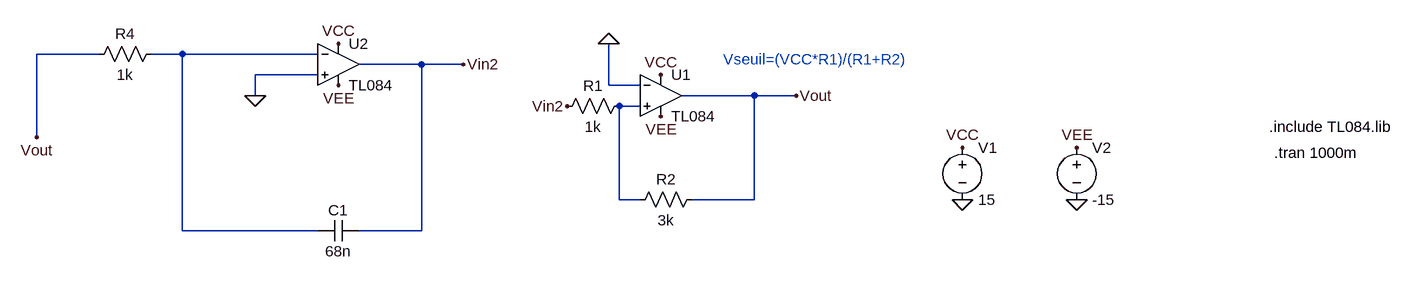
[diagram p0: schematic recovered_oscillo.asc]
recovered_oscillo.asc, the LTspice schematic file:
Version 4
SHEET 1 1840 792
WIRE -704 112 -800 112
WIRE -576 112 -624 112
WIRE -368 112 -576 112
WIRE -208 128 -304 128
WIRE -144 128 -208 128
WIRE -368 144 -464 144
WIRE 80 160 80 96
WIRE 128 160 80 160
WIRE -464 176 -464 144
WIRE 304 176 192 176
WIRE 368 176 304 176
WIRE 128 192 96 192
WIRE -800 240 -800 112
WIRE 96 336 96 192
WIRE 128 336 96 336
WIRE 304 336 304 176
WIRE 304 336 208 336
WIRE -576 384 -576 112
WIRE -368 384 -576 384
WIRE -208 384 -208 128
WIRE -208 384 -304 384
FLAG 624 336 0
FLAG 800 336 0
FLAG 624 256 VCC
FLAG 800 256 VEE
FLAG 160 208 VEE
FLAG 160 144 VCC
FLAG 368 176 Vout
FLAG -336 96 VCC
FLAG -336 160 VEE
FLAG -800 240 Vout
FLAG -144 128 Vin2
FLAG -464 176 0
FLAG 16 192 Vin2
FLAG 80 96 0
SYMBOL Opamps\\opamp2 160 112 R0
SYMATTR InstName U1
SYMATTR Value TL084
SYMBOL voltage 624 240 R0
SYMATTR InstName V1
SYMATTR Value 15
SYMBOL voltage 800 240 R0
SYMATTR InstName V2
SYMATTR Value -15
SYMBOL res 224 320 R90
WINDOW 0 0 56 VBottom 2
WINDOW 3 32 56 VTop 2
SYMATTR InstName R2
SYMATTR Value 3k
SYMBOL Opamps\\opamp2 -336 64 R0
SYMATTR InstName U2
SYMATTR Value TL084
SYMBOL res -608 96 R90
WINDOW 0 0 56 VBottom 2
WINDOW 3 32 56 VTop 2
SYMATTR InstName R4
SYMATTR Value 1k
SYMBOL res 112 176 R90
WINDOW 0 0 56 VBottom 2
WINDOW 3 32 56 VTop 2
SYMATTR InstName R1
SYMATTR Value 1k
SYMBOL cap -304 368 R90
WINDOW 0 0 32 VBottom 2
WINDOW 3 32 32 VTop 2
SYMATTR InstName C1
SYMATTR Value 68n
TEXT 1096 224 Left 2 !.include TL084.lib
TEXT 1104 264 Left 2 !.tran 1000m
TEXT 256 120 Left 2 ;Vseuil=(VCC*R1)/(R1+R2)

The netlist it stands for:
* recovered_oscillo.asc
XU1 N002 0 VCC VEE Vout TL084  ; pins In+ In- V+ V- OUT
V1 VCC 0 15
V2 VEE 0 -15
R2 Vout N002 3k
XU2 0 N001 VCC VEE Vin2 TL084  ; pins In+ In- V+ V- OUT
R4 N001 Vout 1k
R1 N002 Vin2 1k
C1 Vin2 N001 68n
.include TL084.lib
.tran 1000m
* Vseuil=(VCC*R1)/(R1+R2)
.backanno
.end